# Altium project Luna v2.PrjPcb (part 6 of 7)

## Sheet POWER.SchDoc: Luna v2
size A3; SheetNumber: 4; SheetTotal: 4; SPICEModelCacheDYLEPMIM: <root> / <DocumentId>DYLEPMIM</DocumentId> / <CacheFrame Number="0"> / <Model Name="jmk107abj106_a-t" Kind="CKT"> / <Text>* JMK107ABJ106_A-T     SPICE MODEL  ( General Type ) / *-------------------------------------------------------------------------------------------------------- / * Model Generated by TAIYO YUDEN Corporation (http://www.ty-top.com) / * Version 1.0 / * TAIYO YUDEN Control No. 170508_161201 / * Copyright(c) 2012 TAIYO YUDEN CO.,LTD. All Rights Reserved. / *-------------------------------------------------------------------------------------------------------- / * / * Products Name : Multilayer Ceramic Capacitors / * / * Characteristics : / *     Capacitance : 10 uF , Rated Voltage : 6.3V , TCC : X5R / *     Case Size : 1.6 x 0.8 / 0.063 x 0.031 [mm/inch] , Thickness : 0.8 / 0.031 [mm/inch] / *     (Conditions: Temperature = 25 degC , DC Bias Current/Voltage = 0A / 0V) / * / * Frequency Range : 40Hz - 3GHz / * / * External Node Assignments : / * / *  1  o---| |---o  2 / * / *-------------------------------------------------------------------------------------------------------- / .SubCkt JMK107ABJ106_A-T 1 2 / **************************** / C0 1 110 8.9623u / Cm 1 101 0.8356u / C1 101 102 0.81545u / Rc1 101 102 407.78 / C2 102 103 0.12008u / Rc2 102 103 130 / C3 103 110 0.025876u / Rc3 103 110 15.28 / C2m 1 301 1.9009u / C21 301 302 2.2016u / Rc21 301 302 2.0077k / C22 302 303 2.8092u / Rc22 302 303 1.4498k / C23 303 304 5.2572u / Rc23 303 304 495.97 / C24 304 305 1.3408u / Rc24 304 305 104.84 / C25 305 306 2.2469u / Rc25 305 306 43.602 / C26 306 307 3.3576u / Rc26 306 307 28.622 / C27 307 308 0.79127u / Rc27 307 308 12.149 / C28 308 309 0.054389u / Rc28 308 309 2.6395 / C29 309 110 958.23p / Rc29 309 110 12.241 / Rp0 1 110 10Meg / L0 110 120 0.23398n / Lm 120 130 0.21547n / L1 120 121 0.13111n / RL1 121 130 0.16354 / L2 120 122 0.18713n / RL2 122 130 0.82225 / L3 120 123 0.35084n / RL3 123 130 0.11873 / CR 120 124 2.098u / LR 124 125 0.50248n / RR 125 130 34.862m / CL 130 140 1.1716p / LL 130 140 0.18847n / RL 130 140 40.014 / Rs 140 2 4.8237m / **************************** / .ends JMK107ABJ106_A-T</Text> / </Model> / </CacheFrame> / </root>
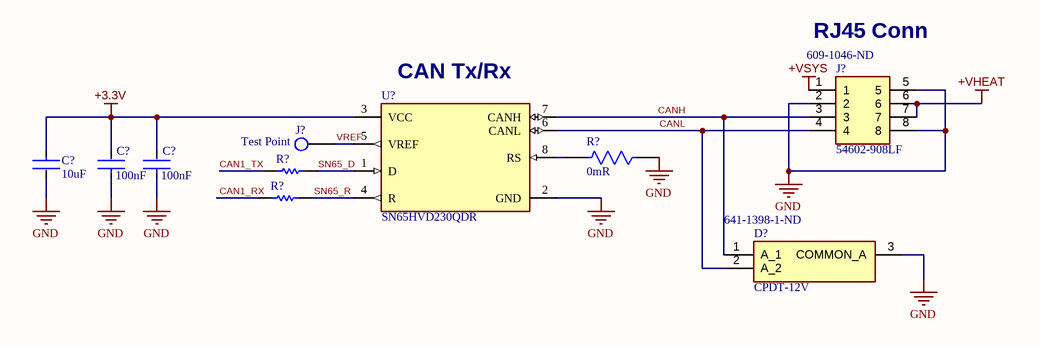
[diagram p26: POWER.SchDoc]

### Parts
(Parts that share a designator on the sheet are numbered #1, #2 ... from top to bottom, then left to right.)
C?#19  Capacitance: 10uF  [FP-0603-L_1_6_0_15-W_0_8-MFG]  (hidden comment: JMK107ABJ106MA-T)
C?#20  Capacitance: 100nF  [FP-GRM155-0_05-MFG]  (hidden comment: GRM155R71C104JA88D)
C?#21  Capacitance: 100nF  [FP-GRM155-0_05-MFG]  (hidden comment: GRM155R71C104JA88D)
D?  CPDT-12V  Supplier Part Number 1: 641-1398-1-ND  [SOT95P280X100-3N]
J?#2  54602-908LF  Supplier Part Number 1: 609-1046-ND  [54602908LF]
J?#3  Test Point  [PC TEST PT 1mm]  (no BOM)
R?#13  RC0402JR-07300RL  [RESC1005X40X25ML05T10]  (value not drawn)
R?#14  Resistance: 0mR  [FP-RC0402-0_4-MFG]  (hidden comment: RC0402JR-070RP)
R?#15  RC0402JR-07300RL  [RESC1005X40X25ML05T10]  (value not drawn)
U?#4  SN65HVD230QDR  [FP-D0008A-IPC_C]

### Nets
+3.3V: C?#19.1 C?#20.2 C?#21.2 U?#4.3(VCC)
+VHEAT: J?#2.6 J?#2.7
+VSYS: J?#2.1
GND: C?#19.2 C?#20.1 C?#21.1 D?.3(COMMON_A) J?#2.2 J?#2.5 J?#2.8 R?#14.1 U?#4.2(GND)
CAN1_RX: R?#15.1
CAN1_TX: R?#13.1
CANH: D?.1(A_1) J?#2.3 U?#4.7(CANH)
CANL: D?.2(A_2) J?#2.4 U?#4.6(CANL)
SN65_D: R?#13.2 U?#4.1(D)
SN65_R: R?#15.2 U?#4.4(R)
VREF: J?#3.1 U?#4.5(VREF)
NetR?#14_2: R?#14.2 U?#4.8(RS)

### Notes on the sheet
- (near J?#2) RJ45 Conn
- (near U?#4) CAN Tx/Rx
- DWG. NO.
- REV.
- SHT.
- THIS DOCUMENT AND THE DATA DISCLOSED HEREIN OR HEREWITH IS THE PROPERTY OF ALTIUM LIMITED AND MAY BE FREELY DISTRIBUTED IN WHOLE. NO RIGHTS ARE RESERVED OR EXPRESS OR IMPLIED WARANTEE GIVEN.
- REVISION
- DESCRIPTION
- DATE
- APPROVED
- ENG:
- APPROVALS
- PROJECT
- DSN:
- CHK:
- REFERENCE DOCUMENTS
- PROJECT REVISION:
- TITLE
- DOCUMENT REVISION:
- DESIGN ITEM:
- BOM:
- FAB DWG:
- PCB DWG:
- ASSY DWG:
- SCALE:
- SIZE
- B
- CAGE CODE
- FILE NAME
- DWG NO.
- SHEET
- OF
- REV

### Library data of the parts
C?#19 = CMP-14477-000812-2: None; Tolerance: 20%; Voltage: 6.3V; Dielectric: X5R; Height: 0.8mm; Depth: 0.8mm; Max Operating Temperature: 85°C; Packaging: Tape and Reel; Length: 1.6mm; Voltage Rating: 6.3V; Mount: Surface Mount; Case/Package: 0603; Termination: Wraparound; Min Operating Temperature: -55°C; Width: 0.031inch; RoHS Compliant: Yes; Thickness: 0.037inch
C?#20 C?#21 = CMP-2008-04599-2: CAP CER 0.1UF 16V X7R 0402; Tolerance: 5%; Height: 0.5mm; Min Operating Temperature: -55°C; Voltage Rating: 16V; Termination: Standard; Dielectric: X7R; Max Operating Temperature: 125°C; Package Quantity: 10000; Case/Package: 0402; Case Code (Metric): 1005; Depth: 0.5mm; Voltage: 16V; Width: 0.5mm; RoHS Compliant: Yes; Length: 1mm; Case Code (Imperial): 0402; Thickness: 0.022inch; Mount: Surface Mount; REACH SVHC: No SVHC; Weight: 0.000212oz; Voltage Rating (DC): 16V; Series: GRM; Packaging: Cut Tape; Radiation Hardening: No; Lead Free: Lead Free
D? = CPDT-12V: TVS Diode (Bi-directional); Manufacturer_Name: Comchip Technology; Datasheet Link: https://datasheet.datasheetarchive.com/originals/distributors/Datasheets-DGA26/1841117.pdf; Height: 1.15mm; Manufacturer_Part_Number: CPDT-12V; Mouser Part Number: 750-CPDT-12V; Mouser Price/Stock: https://www.mouser.co.uk/ProductDetail/Comchip-Technology/CPDT-12V?qs=tw%252BuQ%2FB6PO0KPAaKlo8Fww%3D%3D; Arrow Part Number: CPDT-12V; Arrow Price/Stock: https://www.arrow.com/en/products/cpdt-12v/comchip-technology?region=nac; Supplier 1: Digi-Key
J?#2 = 54602-908LF: Connector; Manufacturer_Name: Amphenol; Datasheet Link: https://cdn.amphenol-cs.com/media/wysiwyg/files/documentation/datasheet/inputoutput/io_modularjack.pdf; Height: 12.85mm; Manufacturer_Part_Number: 54602-908LF; Mouser Part Number: 649-54602-908LF; Mouser Price/Stock: https://www.mouser.co.uk/ProductDetail/Amphenol-FCI/54602-908LF?qs=UB9wU2EYlYSRVSFArXBUoA%3D%3D; Arrow Part Number: 54602-908LF; Arrow Price/Stock: https://www.arrow.com/en/products/54602-908lf/amphenol-fci?region=nac; Supplier 1: Digi-Key
J?#3 = PC TEST PT 1mm dia: MS27478 - Connectors Receptacle Electrical Solder Mounting Solder Type Hermetic Seal 38999 Series II; Manufacturer: Keystone Electronics; Manufacturer Part Number: 5000; Body Material: PBT,Bronze; Plating: Silver; Number of Contacts: 1; Insulation: Insulated; Outside Diameter: 2.54mm; Inside Diameter: 1.27mm; Hole Diameter: 1.6mm; Supplier 1: Digi-Key; RoHS: Yes; Category: Connectors; Stock 1: 604682; Pricing 1: 1=0.42000, 25=0.34080, 100=0.30150, 250=0.28304, 500=0.25230, 1000=0.19884, 2500=0.18180, 5000=0.17044 (USD); Mount: Through Hole,PCB; Color: Red; Contact Material: Bronze; Contact Plating: Silver,Tin; Material: Nylon,Bronze,Silver; Housing Color: Red; Package Quantity: 100; Series: THM; Packaging: Bulk; Orientation: Straight; Number of Ports: 1; Length: 7.62mm; Height: 0.3inch; RoHS Compliant: Yes; REACH SVHC: No SVHC; Lead Free: Lead Free; Flammability Rating: UL94 V-0; ComponentLink1URL: https://datasheet.ciiva.com/11836/0900766b8009b7c7-11836046.pdf?src-supplier=RSComponents; ComponentLink1Description: https://datasheet.ciiva.com/11836/0900766b8009b7c7-11836046.pdf?src-supplier=RSComponents; ComponentLink2URL: https://datasheet.ciiva.com/2917/5000-5004-2917627.pdf?src-supplier=Digi-Key; ComponentLink2Description: https://datasheet.ciiva.com/2917/5000-5004-2917627.pdf?src-supplier=Digi-Key; ComponentLink3URL: https://datasheet.ciiva.com/16883/70182825-16883965.pdf?src-supplier=Allied+Electronics; ComponentLink3Description: https://datasheet.ciiva.com/16883/70182825-16883965.pdf?src-supplier=Allied+Electronics; Supplier Part Number 1: 36-5000-ND
R?#13 R?#15 = CMP-1011-00061-2: 300 Ohm 0402; Manufacturer: Yageo / Phycomp; Part Number: RC0402JR-07300RL
R?#14 = CMP-03412-037830-1: RES SMD 0 OHM JUMPER 1/16W 0402; Max Power Dissipation: 63mW; Width: 0.02inch; Height: 0.016inch; Length: 0.039inch; Number of Terminations: 2; Max Operating Temperature: 155°C; Case Code (Metric): 1005; Resistor Type: Thick Film; RoHS Compliant: Yes; Packaging: Tape and Reel; Min Operating Temperature: -55°C; Case/Package: 0402; Features: Moisture Resistant; Case Code (Imperial): 0402
U?#4 = CMP-0315-00033-3: IC TRANSCEIVER HALF 1/1 8SOIC; Max Supply Current: 17mA; Number of Receivers: 1; Data Rate: 1Mbps; Simplex/Duplex: Half Duplex; Receiver Hysteresis: 100mV; Min Supply Voltage: 3V; Max Supply Voltage: 3.6V; Operating Supply Voltage: 3.3V; Number of Pins: 8; RoHS Compliant: Yes; Case/Package: D; Number of Drivers: 1; Packaging: Tape and Reel; Weight: 0.002822oz; Max Operating Temperature: 125°C; Package Quantity: 2500; Min Operating Temperature: -40°C; Nominal Supply Current: 17mA; Radiation Hardening: No; Number of Transceivers: 1; Contact Plating: Gold; Lead Free: Lead Free

## Sheet Heater.SchDoc: Luna v2
size A4; SheetNumber: 2; SheetTotal: 4; SPICEModelCacheERHLMARL: <root> / <DocumentId>ERHLMARL</DocumentId> / <CacheFrame Number="0"> / <Model Name="jmk107abj106_a-t" Kind="CKT"> / <Text>* JMK107ABJ106_A-T     SPICE MODEL  ( General Type ) / *-------------------------------------------------------------------------------------------------------- / * Model Generated by TAIYO YUDEN Corporation (http://www.ty-top.com) / * Version 1.0 / * TAIYO YUDEN Control No. 170508_161201 / * Copyright(c) 2012 TAIYO YUDEN CO.,LTD. All Rights Reserved. / *-------------------------------------------------------------------------------------------------------- / * / * Products Name : Multilayer Ceramic Capacitors / * / * Characteristics : / *     Capacitance : 10 uF , Rated Voltage : 6.3V , TCC : X5R / *     Case Size : 1.6 x 0.8 / 0.063 x 0.031 [mm/inch] , Thickness : 0.8 / 0.031 [mm/inch] / *     (Conditions: Temperature = 25 degC , DC Bias Current/Voltage = 0A / 0V) / * / * Frequency Range : 40Hz - 3GHz / * / * External Node Assignments : / * / *  1  o---| |---o  2 / * / *-------------------------------------------------------------------------------------------------------- / .SubCkt JMK107ABJ106_A-T 1 2 / **************************** / C0 1 110 8.9623u / Cm 1 101 0.8356u / C1 101 102 0.81545u / Rc1 101 102 407.78 / C2 102 103 0.12008u / Rc2 102 103 130 / C3 103 110 0.025876u / Rc3 103 110 15.28 / C2m 1 301 1.9009u / C21 301 302 2.2016u / Rc21 301 302 2.0077k / C22 302 303 2.8092u / Rc22 302 303 1.4498k / C23 303 304 5.2572u / Rc23 303 304 495.97 / C24 304 305 1.3408u / Rc24 304 305 104.84 / C25 305 306 2.2469u / Rc25 305 306 43.602 / C26 306 307 3.3576u / Rc26 306 307 28.622 / C27 307 308 0.79127u / Rc27 307 308 12.149 / C28 308 309 0.054389u / Rc28 308 309 2.6395 / C29 309 110 958.23p / Rc29 309 110 12.241 / Rp0 1 110 10Meg / L0 110 120 0.23398n / Lm 120 130 0.21547n / L1 120 121 0.13111n / RL1 121 130 0.16354 / L2 120 122 0.18713n / RL2 122 130 0.82225 / L3 120 123 0.35084n / RL3 123 130 0.11873 / CR 120 124 2.098u / LR 124 125 0.50248n / RR 125 130 34.862m / CL 130 140 1.1716p / LL 130 140 0.18847n / RL 130 140 40.014 / Rs 140 2 4.8237m / **************************** / .ends JMK107ABJ106_A-T</Text> / </Model> / </CacheFrame> / </root>
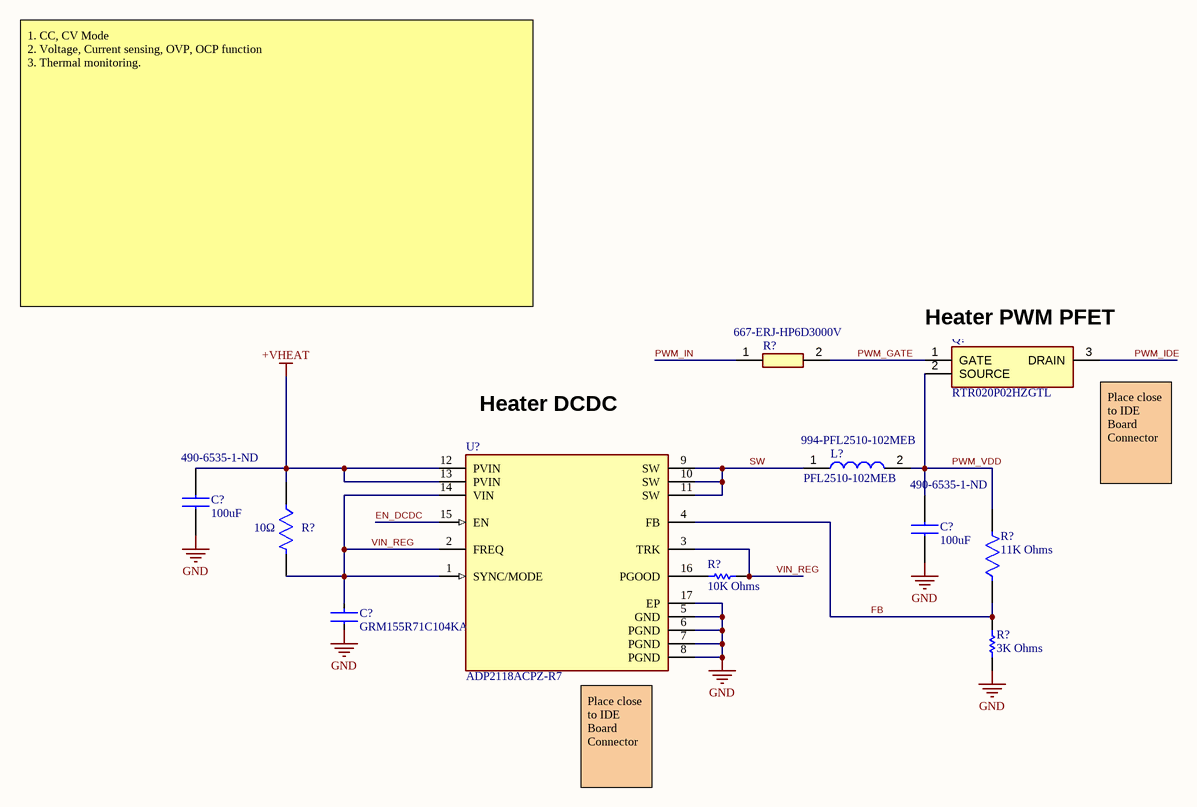
[diagram p27: Heater.SchDoc]

### Parts
(Parts that share a designator on the sheet are numbered #1, #2 ... from top to bottom, then left to right.)
C?#22  100uF  Supplier Part Number 1: 490-6535-1-ND  [CAPC3225X270N]
C?#23  100uF  Supplier Part Number 1: 490-6535-1-ND  [CAPC3225X270N]
C?#24  GRM155R71C104KA88D  [FP-GRM15-MFG]
L?  PFL2510-102MEB  Supplier Part Number 1: 994-PFL2510-102MEB  [PFL2510102MEB]
Q?  RTR020P02HZGTL  [SOT95P280X100-3N]
R?#16  Supplier Part Number 1: 667-ERJ-HP6D3000V  [ERJHP6D1000V]  (hidden comment: ERJHP6D3000V)
R?#17  Resistance: 10Ω  [FP-RT0603-MFG]  (hidden comment: RT0603FRE0710RL)
R?#18  10K Ohms  [RESC1609X55X30LL15T15]
R?#19  11K Ohms  [FP-RT0402-MFG]
R?#20  3K Ohms  [RESC1005X35X25NL10T10]
U?#5  ADP2118ACPZ-R7  [FP-CP-16-26-IPC_B]

### Nets
+VHEAT: C?#22.1 R?#17.1 U?#5.12(PVIN) U?#5.13(PVIN)
GND: C?#22.2 C?#23.2 C?#24.1 R?#20.1 U?#5.5(GND) U?#5.6(PGND) U?#5.7(PGND) U?#5.8(PGND) U?#5.17(EP)
EN_DCDC: U?#5.15(EN)
FB: R?#19.1 R?#20.2 U?#5.4(FB)
PWM_GATE: Q?.1(GATE) R?#16.2
PWM_IDE: Q?.3(DRAIN)
PWM_IN: R?#16.1
PWM_VDD: C?#23.1 L?.2 Q?.2(SOURCE) R?#19.2
SW: L?.1 U?#5.9(SW) U?#5.10(SW) U?#5.11(SW)
VIN_REG: C?#24.2 R?#17.2 R?#18.1 U?#5.1(SYNC/MODE) U?#5.2(FREQ) U?#5.3(TRK) U?#5.14(VIN)
NetR?#18_2: R?#18.2 U?#5.16(PGOOD)

### Notes on the sheet
- 1. CC, CV Mode
  2. Voltage, Current sensing, OVP, OCP function
  3. Thermal monitoring.
- (near Q?) Heater PWM PFET
- (near U?#5) Heater DCDC
- (near Q?) Place close to IDE Board Connector
- (near U?#5) Place close to IDE Board Connector
- DWG. NO.
- REV.
- SHT.
- THIS DOCUMENT AND THE DATA DISCLOSED HEREIN OR HEREWITH IS THE PROPERTY OF ALTIUM LIMITED AND MAY BE FREELY DISTRIBUTED IN WHOLE. NO RIGHTS ARE RESERVED OR EXPRESS OR IMPLIED WARANTEE GIVEN.
- REVISION
- DESCRIPTION
- DATE
- APPROVED
- ENG:
- APPROVALS
- PROJECT
- DSN:
- CHK:
- REFERENCE DOCUMENTS
- PROJECT REVISION:
- TITLE
- DOCUMENT REVISION:
- DESIGN ITEM:
- BOM:
- FAB DWG:
- PCB DWG:
- ASSY DWG:
- SCALE:
- SIZE
- B
- CAGE CODE
- FILE NAME
- DWG NO.
- SHEET
- OF
- REV

### Library data of the parts
C?#22 C?#23 = GRM32ER60J107ME20K: Murata 1210 100uF Capacitor GRM32ER60J107ME20K; Manufacturer_Name: Murata Electronics; Datasheet Link: https://datasheet.datasheetarchive.com/originals/distributors/Datasheets_SAMA/ec4f1577dddcc7a13ddad897a28002d3.pdf; Height: 2.7mm; Manufacturer_Part_Number: GRM32ER60J107ME20K; Mouser Part Number: 81-GRM32ER60J107ME0K; Mouser Price/Stock: https://www.mouser.co.uk/ProductDetail/Murata-Electronics/GRM32ER60J107ME20K?qs=giATsht9l5z2kqRlJFg9kQ%3D%3D; Arrow Part Number: GRM32ER60J107ME20K; Arrow Price/Stock: https://www.arrow.com/en/products/grm32er60j107me20k/murata-manufacturing?region=nac; Supplier 1: Digi-Key; Value: 100uF
C?#24 = CMP-2100-03641-2: CAP CER 0.1UF 16V X7R 0402; Manufacturer: Murata; Standoff Height: 0mm; Tolerance: 10%; Voltage Rating: 16Vdc; Material: Ceramic; Capacitance: 0.10μF; Value: 0.10μF; RoHS: TRUE; Manufacturer Part Number: GRM155R71C104KA88D; Temperature Characteristic: X7R; Octopart: https://octopart.com/grm155r71c104ka88d-murata-196880; Digikey Description: CAP CER 0.1UF 16V X7R 0402; Device Class L3: Ceramic Capacitors; Height: 0.55mm; ComponentLink2Description: Datasheet; Temperature Range Low: -55°C; Ipc Land Pattern Name: CAPC10050X219; ComponentLink2URL: https://search.murata.co.jp/Ceramy/image/img/A01X/G101/ENG/GRM155R71H471KA01-01A.pdf; Device Class L1: Passive Components; Lead Free: yes; Category: Cap; Package: GRM15; Temperature: -55°C to +125°C; Device Class L2: Capacitors; Temperature Range High: +125°C; Mouser Description: 0402 0.1 uF 16V ±10 % Tolerance X7R SMT Multilayer Ceramic Capacitor
L? = PFL2510-102MEB: Inductor; Manufacturer_Name: COILCRAFT; Datasheet Link: https://www.coilcraft.com/getmedia/c12c10f7-342b-4ba5-9fed-9b8db38318c5/pfl2510.pdf; Height: 1.02mm; Manufacturer_Part_Number: PFL2510-102MEB; Mouser Part Number: 994-PFL2510-102MEB; Mouser Price/Stock: https://www.mouser.com/Search/Refine.aspx?Keyword=994-PFL2510-102MEB; Supplier 1: Mouser
Q? = RTR020P02HZGTL: Transistor; Manufacturer_Name: ROHM Semiconductor; Datasheet Link: https://componentsearchengine.com/Datasheets/1/RTR020P02HZGTL.pdf; Height: 1mm; Manufacturer_Part_Number: RTR020P02HZGTL; Mouser Part Number: 755-RTR020P02HZGTL; Mouser Price/Stock: https://www.mouser.co.uk/ProductDetail/ROHM-Semiconductor/RTR020P02HZGTL?qs=qSfuJ%252Bfl%2Fd4ZBjtDX1OQNg%3D%3D; Supplier 1: Digi-Key; Supplier Part Number 1: 846-RTR020P02HZGTLCT-ND
R?#16 = ERJHP6D3000V: Resistor; Manufacturer_Name: Panasonic; Datasheet Link: http://industrial.panasonic.com/cdbs/www-data/pdf/RDQ0000/ast-ind-151033.pdf; Height: 0.7mm; Manufacturer_Part_Number: ERJHP6D3000V; Supplier 1: Mouser
R?#17 = CMP-03412-033408-1: RES SMD 10 OHM 1% 1/10W 0603; Manufacturer: Yageo; Voltage Rating: 75V; Power Rating: 0.1W; Temperature Coefficient: 50 ppm/°C; Tolerance: 0.01; Value: 10Ω; Footprint Url: http://www.yageo.com/exep/pages/download/literatures/PYu-R_Mount_10.pdf; Ipc Land Pattern Name: RESC16080X45; RoHS: TRUE; Device Class L2: Resistors; Device Class L3: Chip SMD Resistors; Category: Res; Device Class L1: Passive Components; Manufacturer Part Number: RT0603FRE0710RL; ComponentLink2URL: http://www.yageo.com/documents/recent/PYu-RT_1-to-0.01_RoHS_L_9.pdf; Temperature Range Low: -55°C; Height: 0.55mm; Digikey Description: RES SMD 10 OHM 1% 1/10W 0603; Temperature Range High: +155°C; Lead Free: Yes; Composition: Thin Film; Mouser Description: Thin Film Resistors - SMD 1/10W 10 ohm 1% 50ppm; Automotive: No; Package: RT0603; Temperature: -55°C to +155°C; Series: RT; ComponentLink2Description: Datasheet; Octopart: https://octopart.com/rt0603fre0710rl-yageo-39827693
R?#18 = CMP-1012-00623-3: Chip Resistor, 10 KOhm, +/- 1%, 0.1 W, -55 to 155 degC, 0603 (1608 Metric), ERJ3EKF1002V; Manufacturer: Panasonic; Voltage Rating: 75V; Case\/Package: 0603; Power Rating: 100mW; Resistance: 10KOhm; Temperature Coefficient: 100ppm\/degreesC; Number of Pins: 2; Package Reference: 603; Depth: 0.8mm; Mount: SurfaceMount; Package Description: 2-Pin Surface Mount Device, Body 1.6 x 0.85 mm; Datasheet Version: 02/2017; Length: 1.6mm; Lead Free: LeadFree; Height: 0.45mm; Number of Terminations: 2; Max Power Dissipation: 100mW; Min Operating Temperature: -55degC; Datasheet URL: https://industrial.panasonic.com/cdbs/www-data/pdf/RDA0000/AOA0000C304.pdf; Termination: SMD/SMT; Case Code (Metric): 1608; Case Code (Imperial): 0603; Tolerance: 1%; Max Operating Temperature: 155degC; RoHSCompliant: true; Voltage Rating (DC): 75V; Radiation Hardening: No; Packaging: TapeandReel; Composition: ThickFilm; Mounting Technology: SurfaceMount; Manufacturer URL: http://www.panasonic.com/; Width: 0.031inch; REACH SVHC: NoSVHC; Contact Plating: Tin; Military Standard: Not; Package Quantity: 1
R?#19 = CMP-03412-023742-1: Yageo RES SMD 11K OHM 0.5% 1/16W 0402 RT0402DRE0711KL; Value: 11KΩ; Power Rating: 0.063W; Tolerance: 0.005; Voltage Rating: 50V; Temperature Coefficient: 50 ppm/°C; Composition: Thin Film; Lead Free: Yes; Manufacturer Part Number: RT0402DRE0711KL; ComponentLink2URL: http://www.yageo.com/documents/recent/PYu-RT_1-to-0.01_RoHS_L_9.pdf; Device Class L3: Chip SMD Resistors; Resistance: 11KΩ; Temperature Range High: +155°C; Height: 0.35mm; Octopart: https://octopart.com/rt0402dre0711kl-yageo-1240623; Automotive: No; Manufacturer: Yageo; Device Class L1: Passive Components; Ipc Land Pattern Name: RESC10050X30; Series: RT; ComponentLink2Description: Datasheet; RoHS: TRUE; Category: Res; Temperature: -55°C to +155°C; Device Class L2: Resistors; Package: RT0402; Temperature Range Low: -55°C; Footprint Url: http://www.yageo.com/exep/pages/download/literatures/PYu-R_Mount_10.pdf; Digikey Description: RES SMD 11K OHM 0.5% 1/16W 0402
R?#20 = CMP-2002-02648-1: Yageo 3K Ohms 0402 RT0402FRE073KL; Manufacturer: Yageo; Part Number: RT0402FRE073KL
U?#5 = CMP-09139-000158-1: IC REG BUCK ADJ 3A 16LFCSP; Min Output Voltage: 600mV; Output Type: Adjustable; Output Configuration: Positive; Min Input Voltage: 2.3V; Number of Outputs: 1; Operating Supply Current: 150uA; Synchronous Rectifier: Yes; Max Output Voltage: 5.5V; Switching Frequency: 1.2MHz; Output Current: 3A; Number of Pins: 16; Lead Free: Contains Lead; Max Operating Temperature: 125°C; Packaging: Tape and Reel; RoHS Compliant: Yes; Case/Package: LFCSP EP; Max Output Current: 3A; Mount: Surface Mount; Min Operating Temperature: -40°C; Output Voltage: 5.5V; Operating Supply Voltage: 5.5V; Nominal Supply Current: 150uA; Series: -; Max Input Voltage: 5.5V; Termination: SMD/SMT; Contact Plating: Tin; REACH SVHC: No SVHC